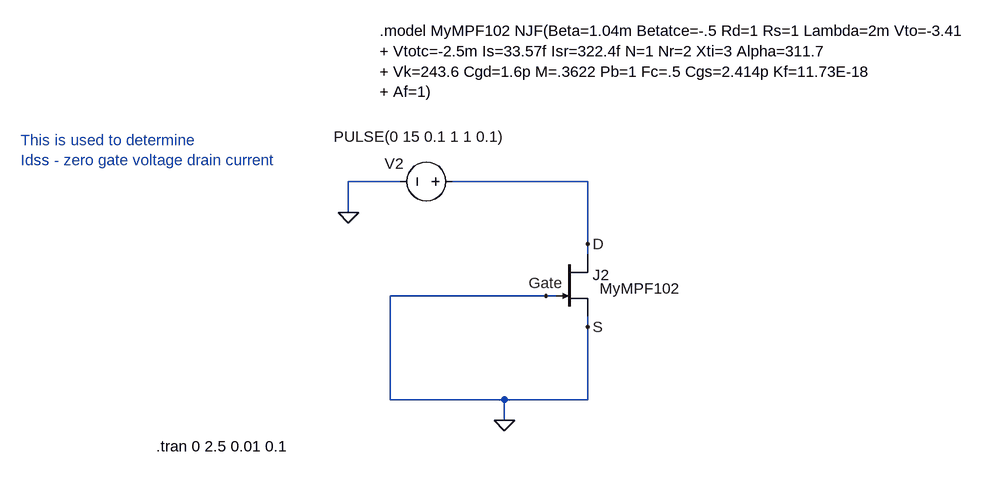
[diagram p0: schematic jfet_Id_Vds.asc]
jfet_Id_Vds.asc, the LTspice schematic file:
Version 4
SHEET 1 1424 680
WIRE -176 -16 -256 -16
WIRE 112 -16 -96 -16
WIRE -256 32 -256 -16
WIRE 112 80 112 -16
WIRE 112 96 112 80
WIRE 48 160 -192 160
WIRE 64 160 48 160
WIRE 112 208 112 192
WIRE -192 320 -192 160
WIRE -16 320 -192 320
WIRE 112 320 112 208
WIRE 112 320 -16 320
WIRE -16 352 -16 320
FLAG 112 80 D
FLAG -16 352 0
FLAG -256 32 0
FLAG 48 160 Gate
FLAG 112 208 S
SYMBOL njf 64 96 R0
WINDOW 3 67 53 Left 2
SYMATTR Value MyMPF102
SYMATTR InstName J2
SYMBOL voltage -80 -16 R90
WINDOW 123 24 124 Left 2
WINDOW 39 0 0 Left 0
WINDOW 0 -28 91 VRight 2
WINDOW 3 -69 -65 VRight 2
SYMATTR InstName V2
SYMATTR Value PULSE(0 15 0.1 1 1 0.1)
TEXT -208 -248 Left 2 !.model MyMPF102 NJF(Beta=1.04m Betatce=-.5 Rd=1 Rs=1 Lambda=2m Vto=-3.41\n+ Vtotc=-2.5m Is=33.57f Isr=322.4f N=1 Nr=2 Xti=3 Alpha=311.7\n+ Vk=243.6 Cgd=1.6p M=.3622 Pb=1 Fc=.5 Cgs=2.414p Kf=11.73E-18\n+ Af=1)
TEXT -552 392 Left 2 !.tran 0 2.5 0.01 0.1
TEXT -760 -80 Left 2 ;This is used to determine\nIdss - zero gate voltage drain current

The netlist it stands for:
* jfet_Id_Vds.asc
J2 D 0 0 MyMPF102
V2 D 0 PULSE(0 15 0.1 1 1 0.1)
.model NJF NJF
.model PJF PJF
.lib standard.jft
.model MyMPF102 NJF(Beta=1.04m Betatce=-.5 Rd=1 Rs=1 Lambda=2m Vto=-3.41
+ Vtotc=-2.5m Is=33.57f Isr=322.4f N=1 Nr=2 Xti=3 Alpha=311.7
+ Vk=243.6 Cgd=1.6p M=.3622 Pb=1 Fc=.5 Cgs=2.414p Kf=11.73E-18
+ Af=1)
.tran 0 2.5 0.01 0.1
* This is used to determine
* Idss - zero gate voltage drain current
.backanno
.end

* Results of the author's LTspice run, read from the files saved beside the schematic
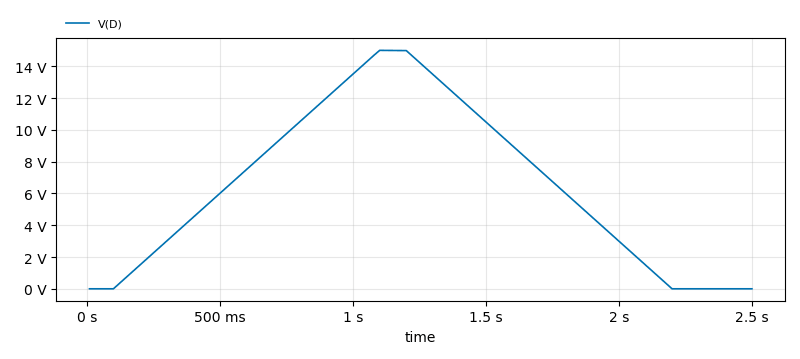
[diagram p1: Transient Analysis of jfet_Id_Vds.asc, plotted from the saved traces]
* Transient Analysis, 1 run:
*   V(D): min 0 V, max 15 V, average 6.626 V, rms 8.488 V, last 0 V